# EAGLE design Power HUB (EAGLE 9.0.0)
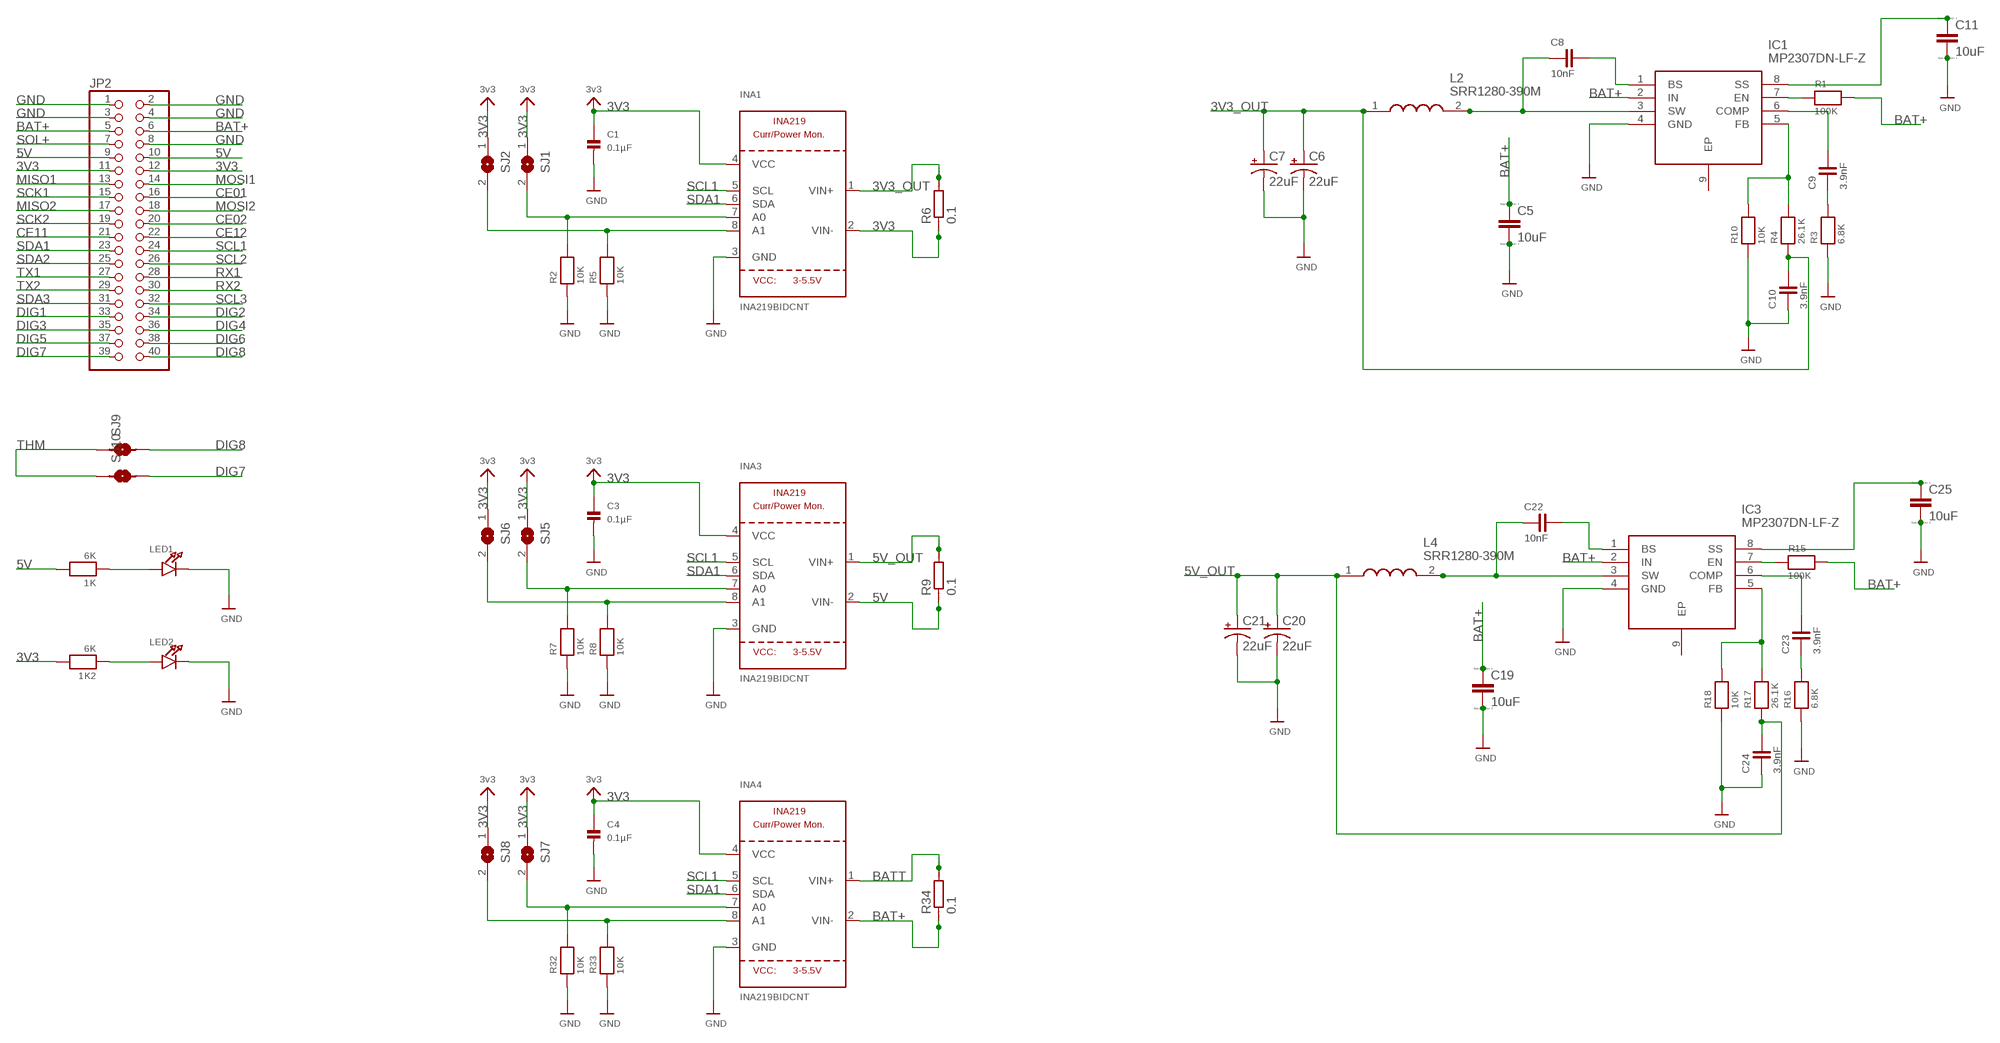
[diagram p0: schematic, sheet 1, part 1 of 2]
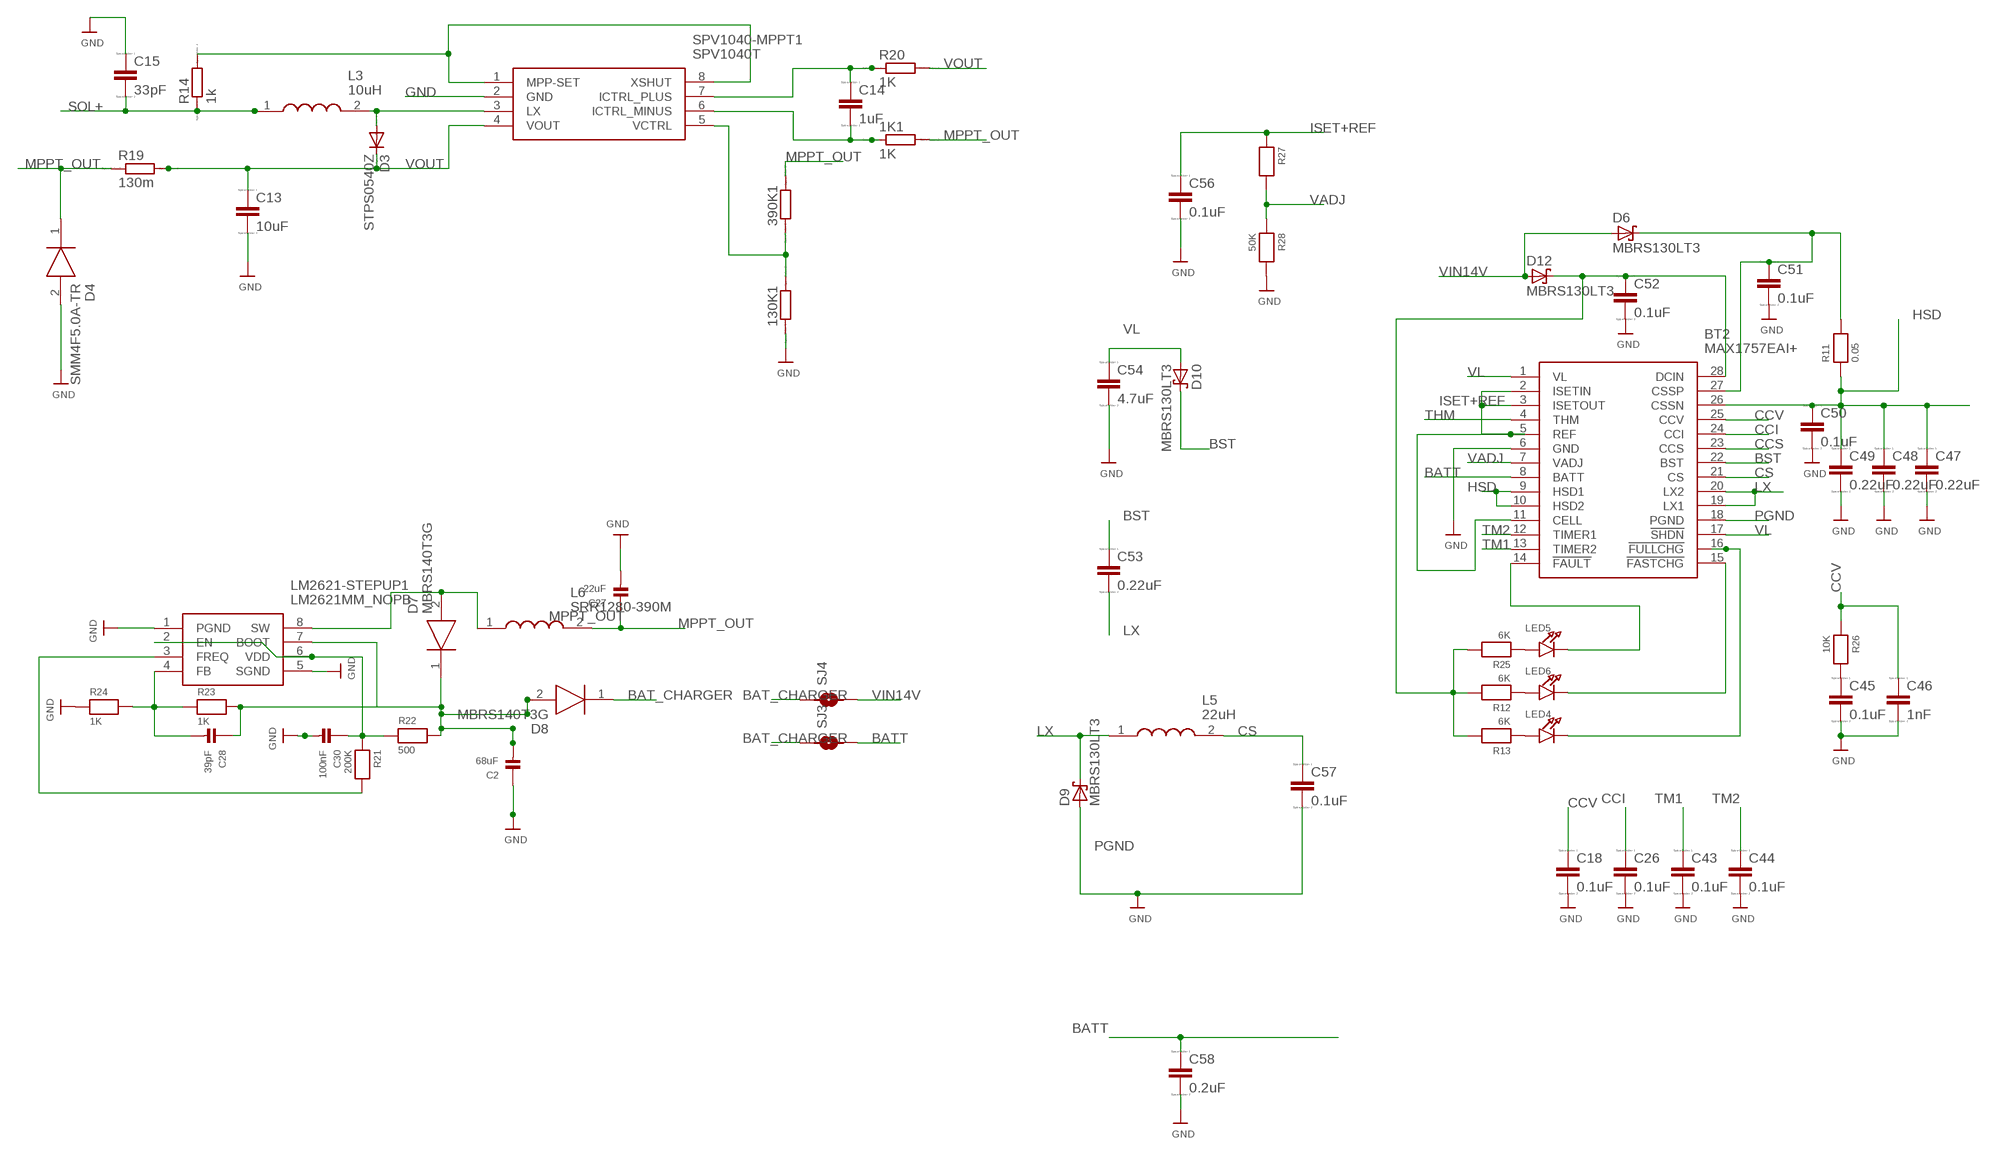
[diagram p1: schematic, sheet 1, part 2 of 2]

## Parts
1K  6K  RESISTOR1206  [1206]
1K1  1K  RR1206  [R1206]
1K2  6K  RESISTOR1206  [1206]
130K1  RR1206  [R1206]
390K1  RR1206  [R1206]
BT2  MAX1757EAI+  [SOP65P778X199-28N]
C1  0.1µF  CAP_CERAMIC1206  [1206]
C2  68uF  CAP_CERAMIC1206  [1206]
C3  0.1µF  CAP_CERAMIC1206  [1206]
C4  0.1µF  CAP_CERAMIC1206  [1206]
C5  10uF  CC1206  [C1206]
C6  22uF  47UF-10V-10%(TANT)  [EIA3528]
C7  22uF  47UF-10V-10%(TANT)  [EIA3528]
C8  10nF  CAPACITOR-0805  [0805]
C9  3.9nF  CAPACITOR-0805  [0805]
C10  3.9nF  CAPACITOR-0805  [0805]
C11  10uF  CC1206  [C1206]
C13  10uF  CC1206  [C1206]
C14  1uF  CC1206  [C1206]
C15  33pF  CC1206  [C1206]
C18  0.1uF  CC1206  [C1206]
C19  10uF  CC1206  [C1206]
C20  22uF  47UF-10V-10%(TANT)  [EIA3528]
C21  22uF  47UF-10V-10%(TANT)  [EIA3528]
C22  10nF  CAPACITOR-0805  [0805]
C23  3.9nF  CAPACITOR-0805  [0805]
C24  3.9nF  CAPACITOR-0805  [0805]
C25  10uF  CC1206  [C1206]
C26  0.1uF  CC1206  [C1206]
C27  22uF  CAP_CERAMIC1206  [1206]
C28  39pF  CAP_CERAMIC1206  [1206]
C30  100nF  CAP_CERAMIC1206  [1206]
C43  0.1uF  CC1206  [C1206]
C44  0.1uF  CC1206  [C1206]
C45  0.1uF  CC1206  [C1206]
C46  1nF  CC1206  [C1206]
C47  0.22uF  CC1206  [C1206]
C48  0.22uF  CC1206  [C1206]
C49  0.22uF  CC1206  [C1206]
C50  0.1uF  CC1206  [C1206]
C51  0.1uF  CC1206  [C1206]
C52  0.1uF  CC1206  [C1206]
C53  0.22uF  CC1206  [C1206]
C54  4.7uF  CC1206  [C1206]
C56  0.1uF  CC1206  [C1206]
C57  0.1uF  CC1206  [C1206]
C58  0.2uF  CC1206  [C1206]
D3  STPS0540Z  CGRM4001-G  [SOD-123_MINI-SMA]
D4  SMM4F5.0A-TR  [STMITE]
D6  MBRS130LT3  [SMB]
D7  MBRS140T3G  [DIOM5436X247N]
D8  MBRS140T3G  [DIOM5436X247N]
D9  MBRS130LT3  [SMB]
D10  MBRS130LT3  [SMB]
D12  MBRS130LT3  [SMB]
IC1  MP2307DN-LF-Z  [SOIC127P600X170-9N]
IC3  MP2307DN-LF-Z  [SOIC127P600X170-9N]
INA1  INA219BIDCNT  INA219  [SOT23-8]
INA3  INA219BIDCNT  INA219  [SOT23-8]
INA4  INA219BIDCNT  INA219  [SOT23-8]
JP2  PINHD-2X20  [2X20]
L2  SRR1280-390M  [SRR1280-220M]
L3  10uH  SRR1280-390M  [SRR1280-220M]
L4  SRR1280-390M  [SRR1280-220M]
L5  22uH  74406043100  [INDPM4848X280N]
L6  SRR1280-390M  [SRR1280-220M]
LED1  LED1206  [CHIPLED_1206]
LED2  LED1206  [CHIPLED_1206]
LED4  LED1206  [CHIPLED_1206]
LED5  LED1206  [CHIPLED_1206]
LED6  LED1206  [CHIPLED_1206]
LM2621-STEPUP1  LM2621MM_NOPB  [SOP65P490X110-8N]
R1  100K  RESISTOR1206  [1206]
R2  10K  RESISTOR1206  [1206]
R3  6.8K  RESISTOR1206  [1206]
R4  26.1K  RESISTOR1206  [1206]
R5  10K  RESISTOR1206  [1206]
R6  0.1  RR2512  [R2512]
R7  10K  RESISTOR1206  [1206]
R8  10K  RESISTOR1206  [1206]
R9  0.1  RR2512  [R2512]
R10  10K  RESISTOR1206  [1206]
R11  0.05  RESISTOR1206  [1206]
R12  6K  RESISTOR1206  [1206]
R13  6K  RESISTOR1206  [1206]
R14  1k  RR1206  [R1206]
R15  100K  RESISTOR1206  [1206]
R16  6.8K  RESISTOR1206  [1206]
R17  26.1K  RESISTOR1206  [1206]
R18  10K  RESISTOR1206  [1206]
R19  130m  RR1206  [R1206]
R20  1K  RR1206  [R1206]
R21  200K  RESISTOR1206  [1206]
R22  500  RESISTOR1206  [1206]
R23  1K  RESISTOR1206  [1206]
R24  1K  RESISTOR1206  [1206]
R25  6K  RESISTOR1206  [1206]
R26  10K  RESISTOR1206  [1206]
R27  RESISTOR1206  [1206]
R28  50K  RESISTOR1206  [1206]
R32  10K  RESISTOR1206  [1206]
R33  10K  RESISTOR1206  [1206]
R34  0.1  RR2512  [R2512]
SJ1  SOLDERJUMPERREFLOW_NOPASTE  [SOLDERJUMPER_REFLOW_NOPASTE]
SJ2  SOLDERJUMPERREFLOW_NOPASTE  [SOLDERJUMPER_REFLOW_NOPASTE]
SJ3  SMD-JUMPER-2  [SMD-JUMPER-2]
SJ4  SMD-JUMPER-2  [SMD-JUMPER-2]
SJ5  SOLDERJUMPERREFLOW_NOPASTE  [SOLDERJUMPER_REFLOW_NOPASTE]
SJ6  SOLDERJUMPERREFLOW_NOPASTE  [SOLDERJUMPER_REFLOW_NOPASTE]
SJ7  SOLDERJUMPERREFLOW_NOPASTE  [SOLDERJUMPER_REFLOW_NOPASTE]
SJ8  SOLDERJUMPERREFLOW_NOPASTE  [SOLDERJUMPER_REFLOW_NOPASTE]
SJ9  SMD-JUMPER-2  [SMD-JUMPER-2]
SJ10  SMD-JUMPER-2  [SMD-JUMPER-2]
SPV1040-MPPT1  SPV1040T  [SOP65P640X120-8N]

## Nets
3V3: 1K2.2 C1.1 C3.1 C4.1 INA1.2(VIN-) INA1.4(VCC) INA3.4(VCC) INA4.4(VCC) JP2.11 JP2.12 R6.1 SJ1.1 SJ2.1 SJ5.1 SJ6.1 SJ7.1 SJ8.1 ; supply symbol labelled 3v3
3V3_OUT: C6.A(+) C7.A(+) C10.2 INA1.1(VIN+) L2.1 R4.1 R6.2
5V: 1K.2 INA3.2(VIN-) JP2.9 JP2.10 R9.1
5V_OUT: C20.A(+) C21.A(+) C24.2 INA3.1(VIN+) L4.1 R9.2 R17.1
BAT+: C5.1 C19.1 IC1.2(IN) IC3.2(IN) INA4.2(VIN-) JP2.5 JP2.6 R1.2 R15.2 R34.1
BAT_CHARGER: D8.1(K) SJ3.1 SJ4.1
BATT: BT2.8(BATT) C58.1 INA4.1(VIN+) R34.2 SJ3.2
BST: BT2.22(BST) C53.1 D10.C
CCI: BT2.24(CCI) C26.1
CCS: BT2.23(CCS)
CCV: BT2.25(CCV) C18.1 C46.1 R26.1
CE01: JP2.16
CE02: JP2.20
CE11: JP2.21
CE12: JP2.22
CS: BT2.21(CS) C57.1 L5.2
DIG1: JP2.33
DIG2: JP2.34
DIG3: JP2.35
DIG4: JP2.36
DIG5: JP2.37
DIG6: JP2.38
DIG7: JP2.39 SJ10.2
DIG8: JP2.40 SJ9.2
GND: 130K1.1 BT2.6(GND) C1.2 C2.1 C3.2 C4.2 C5.2 C6.C(-) C7.C(-) C10.1 C11.2 C13.2 C15.1 C19.2 C20.C(-) C21.C(-) C24.1 C25.2 C27.2 C30.2 C45.2 C46.2 C47.2 C48.2 C49.2 C54.2 C56.2 C58.2 D4.2(A) IC1.4(GND) IC3.4(GND) INA1.3(GND) INA3.3(GND) INA4.3(GND) JP2.1 JP2.2 JP2.3 JP2.4 JP2.8 LED1.C LED2.C LM2621-STEPUP1.1(PGND) LM2621-STEPUP1.5(SGND) R2.1 R3.1 R5.1 R7.1 R8.1 R10.1 R16.1 R18.1 R24.1 R32.1 R33.1 SPV1040-MPPT1.2(GND)
HSD: BT2.9(HSD1) BT2.10(HSD2) BT2.26(CSSN) C47.1 C48.1 C49.1 C50.1 R11.1
ISET+REF: BT2.2(ISETIN) BT2.3(ISETOUT) BT2.5(REF) BT2.11(CELL) C56.1 R27.1
LX: BT2.19(LX1) BT2.20(LX2) C53.2 D9.C L5.1
MISO1: JP2.13
MISO2: JP2.17
MOSI1: JP2.14
MOSI2: JP2.18
MPPT_OUT: 1K1.2 390K1.2 C27.1 D4.1(K) L6.2 R19.1
N$1: INA1.8(A1) R5.2 SJ2.2
N$2: INA1.7(A0) R2.2 SJ1.2
N$3: C8.2 IC1.1(BS)
N$4: C11.1 IC1.8(SS)
N$5: INA3.8(A1) R8.2 SJ6.2
N$6: INA3.7(A0) R7.2 SJ5.2
N$7: C8.1 IC1.3(SW) L2.2
N$8: IC1.7(EN) R1.1
N$9: C9.2 IC1.6(COMP)
N$10: C9.1 R3.2
N$11: IC1.5(FB) R4.2 R10.2
N$12: 1K2.1 LED2.A
N$13: 1K.1 LED1.A
N$15: BT2.28(DCIN) C52.1 D12.C R12.2 R13.2 R25.2
N$16: BT2.14(!FAULT) LED5.C
N$17: D3.A L3.2 SPV1040-MPPT1.3(LX)
N$18: R14.2 SPV1040-MPPT1.1(MPP-SET) SPV1040-MPPT1.8(XSHUT)
N$19: C22.2 IC3.1(BS)
N$20: C25.1 IC3.8(SS)
N$21: C22.1 IC3.3(SW) L4.2
N$22: IC3.7(EN) R15.1
N$23: C23.2 IC3.6(COMP)
N$24: C23.1 R16.2
N$25: IC3.5(FB) R17.2 R18.2
N$26: C14.1 R20.1 SPV1040-MPPT1.7(ICTRL_PLUS)
N$27: 1K1.1 C14.2 SPV1040-MPPT1.6(ICTRL_MINUS)
N$28: 130K1.2 390K1.1 SPV1040-MPPT1.5(VCTRL)
N$29: BT2.15(!FASTCHG) LED6.C
N$30: BT2.16(!FULLCHG) LED4.C
N$35: INA4.8(A1) R33.2 SJ8.2
N$36: C2.2 D7.1(K) D8.2(A) LM2621-STEPUP1.7(BOOT) R22.2
N$37: C30.1 LM2621-STEPUP1.2(EN) LM2621-STEPUP1.6(VDD) R21.1 R22.1
N$38: LM2621-STEPUP1.3(FREQ) R21.2
N$39: C28.2 LM2621-STEPUP1.4(FB) R23.1 R24.2
N$40: C28.1 R23.2
N$42: D7.2(A) L6.1 LM2621-STEPUP1.8(SW)
N$43: INA4.7(A0) R32.2 SJ7.2
N$50: BT2.27(CSSP) C51.1 D6.C R11.2
PGND: BT2.18(PGND) C57.2 D9.A ; supply symbol labelled GND
RX1: JP2.28
RX2: JP2.30
SCK1: JP2.15
SCK2: JP2.19
SCL1: INA1.5(SCL) INA3.5(SCL) INA4.5(SCL) JP2.24
SCL2: JP2.26
SCL3: JP2.32
SDA1: INA1.6(SDA) INA3.6(SDA) INA4.6(SDA) JP2.23
SDA2: JP2.25
SDA3: JP2.31
SOL+: C15.2 JP2.7 L3.1 R14.1
THM: BT2.4(THM) SJ9.1 SJ10.1
TM1: BT2.13(TIMER2) C43.1
TM2: BT2.12(TIMER1) C44.1
TX1: JP2.27
TX2: JP2.29
VADJ: BT2.7(VADJ) R27.2 R28.1
VIN14V: D6.A D12.A SJ4.2
VL: BT2.1(VL) BT2.17(!SHDN) C54.1 D10.A
VOUT: C13.1 D3.C R19.2 R20.2 SPV1040-MPPT1.4(VOUT)
Unconnected: C18.2 C26.2 C43.2 C44.2 C45.1 C50.2 C51.2 C52.2 IC1.9(EP) IC3.9(EP) LED4.A LED5.A LED6.A R12.1 R13.1 R25.1 R26.2 R28.2

## Library data of the parts
1K 1K2 R1-R5 R7 R8 R10-R13 R15-R18 R21-R28 R32 R33 = microbuilder:RESISTOR: Resistors 0402 - 0402 Surface Mount Package 22 Ohm 1% 1/16W [Digikey: 311-22.0LRTR-ND] 33 Ohm 5% 1/16W 1.0K 5% 1/16W 1.5K 5% 1/16W 2.0K 1% 1/16W 10.0K 1% 1/16W [Digikey: 311-10.0KLRTR-ND] 10.0K 5% 1/16W [Digikey: RMCF0402JT10K0TR-ND] 12.1K 1% 1/16W [Digikey: 311-22.0LRTR-ND] 100.0K 5% 1/16W 0603 - 0603 Surface Mount Package 0 Ohm 1/10 Watt 1% Resistor 15 Ohm 1/10 Watt 1% Resistor 33 Ohm 1/10 Watt 1% Resistor 49.9 Ohm 1/10 Watt 1% Resistor 100 Ohm 1/10 Watt 1% Resistor 150 Ohm 1/10 Watt 1% Resistor 240 Ohm 1/10 Watt 1% Resistor 390 Ohm 1/10 Watt 1% Resistor 560 Ohm 1/10 Watt 1% Resistor 680 Ohm 1/10 Watt 1% Resistor 750 Ohm 1/10 Watt 1% Resistor 1.0K Ohm 1/10 Watt 1% Resistor 1.5K Ohm 1/10 Watt 1% Resistor 2.0K Ohm 1/10 Watt 1% Resistor 2.2K Ohm 1/10 Watt 1% Resistor 3.3K Ohm 1/10 Watt 1% Resistor 4.7K Ohm 1/10 Watt 1% Resistor 10.0K Ohm 1/10 Watt 1% Resistor 12.0K Ohm 1/10 Watt 1% Resistor 12.1K Ohm 1/10 Watt 1% Resistor 20.0K Ohm 1/10 Watt 1% Resistor 33.0K Ohm 1/10 Watt 1% Resistor 100.0K Ohm 1/10 Watt 1% Resistor 0805 - 0805 Surface Mount Package 0 Ohm 1/8 Watt 1% Resistor 33 Ohm 1/8 Watt 1% Resistor 100 Ohm 1/8 Watt 1% Resistor 150 Ohm 1/8 Watt 1% Resistor 200 Ohm 1/8 Watt 1% Resistor 240 Ohm 1/8 Watt 1% Resistor 330 Ohm 1/8 Watt 1% Resistor 390 Ohm 1/8 Watt 1% Resistor 470 Ohm 1/8 Watt 1% Resistor 1.0K Ohm 1/8 Watt 1% Resistor 1.5K Ohm 1/8 Watt 1% Resistor 2.0K Ohm 1/8 Watt 1% Resistor 4.7K Ohm 1/8 Watt 1% Resistor 5.1K Ohm 1/8 Watt 1% Resistor 5.6K Ohm 1/8 Watt 1% Resistor 10.0K Ohm 1/8 Watt 1% Resistor 22.0K Ohm 1/8 Watt 1% Resistor 33.0K Ohm 1/8 Watt 1% Resistor 100K Ohm 1/8 Watt 1% Resistor 1206 - 1206 Surface Mount Package 2012 - 2010 Surface Mount Package 0.11 Ohm 1/2 Watt 1% Resistor - Digikey: RHM.11UCT-ND
1K1 130K1 390K1 R6 R9 R14 R19 R20 R34 = eagle-ltspice:R: RESISTOR, European symbol; SPICEMODEL: NONE; SPICEPREFIX: R
BT2 = MAX1757EAI+:MAX1757EAI+: MAXIM INTEGRATED PRODUCTS - MAX1757EAI+ - BATTERY CHARGER, LI-ION, 1.5A, SSOP-28 Source: Datasheet <http://www.farnell.com/datasheets/2001967.pdf>; ARROW_PART_NUMBER: MAX1757EAI+; DESCRIPTION: MAXIM INTEGRATED PRODUCTS - MAX1757EAI+ - BATTERY CHARGER, LI-ION, 1.5A, SSOP-28; HEIGHT: 1.99mm; MANUFACTURER_NAME: Maxim Integrated; MANUFACTURER_PART_NUMBER: MAX1757EAI+
C1-C4 C27 C28 C30 = microbuilder:CAP_CERAMIC: Ceramic Capacitors 0402 - 0402 Surface Mount Capacitors 16pF 50V 5% [Digikey: 445-4899-2-ND] 18pF 50V 5% [Digikey: 490-1281-2-ND] 22pF 50V 5% [Digikey: 490-1283-2-ND] 68pF 50V 5% [Digikey: 490-1289-2-ND] 0.1uF 10V 10% [Digikey: 490-1318-2-ND] 1.0uF 6.3V 10% [Digikey: 490-1320-2-ND] 0603 - 0603 Surface Mount Capacitors 16 pF 50V 5% [Digikey: 445-5051-2-ND] 22 pF 50V [Digikey: PCC220ACVTR-ND] 33 pF 50V 5% [Digikey: 490-1415-1-ND] 56pF 50V 5% [Digikey: 490-1421-1-ND] 220pF 50V 5% [Digikey: 445-1285-1-ND] 680 pF 50V 2200 pF 50V 5% C0G [Digikey: 445-1297-1-ND] 5600 pF 100V 5% X7R [Digikey: 478-3711-1-ND] 0.1 µF 25V 10% [Digikey: PCC2277TR-ND] 0.22 µF 16V 10% X7R [Digikey: 445-1318-1-ND] 1.0 µF 25V 10% [Digikey: 445-5146-2-ND] 0603 - RF Specific 3pF 250V +/-0.1pF RF [Digikey: 712-1347-1-ND] 18 pF 250V 5% [Digikey: 478-3505-1-ND or 712-1322-1-ND] 56 pF 250V 5% C0G RF [Digikey: 490-4867-1-ND] 68 pF 250V RF [Digikey: 490-4868-1-ND] 0805 - 0805 Surface Mount Capacitors 220 pF 250V 2% RF Ceramic Capacitor [Digikey: 712-1398-1-ND] 1000 pF 50V 2% NP0 Ceramic Capacitor [Digikey: 478-3760-1-ND] 0.1 µF 25V 10% Ceramic Capacitor [Digikey: PCC1828TR-ND] 1.0 µF 16V 10% Ceramic Capacitor[Digikey: 490-1691-2-ND] 10.0 µF 10V 10% Ceramic Capacitor[Digikey: 709-1228-1-ND] 10.0 uF 16V 10% Ceramic Capacitor [Digikey: 478-5165-2-ND] 47 uF 6.3V 20% Ceramic Capacitor [Digikey: 587-1779-1-ND or 399-5506-1-ND] 1206 - 1206 Surface Mount Capacitors 47uF 10V 20% Ceramic Capacitor [Digikey: 490-5528-1-ND or 399-5508-1-ND or 445-6010-1-ND] 100uF 6.3V -20%, +80% Y5V Ceramic Capacitor (Digikey: 490-4512-1-ND, Mouser: 81-GRM31CF50J107ZE1L)
C5 C11 C13-C15 C18 C19 C25 C26 C43-C54 C56-C58 = eagle-ltspice:C: CAPACITOR, European symbol; SPICEMODEL: NONE; SPICEPREFIX: C
C6 C7 C20 C21 = SparkFun-Capacitors:47UF-10V-10%(TANT): CAP-08310 47uF Tantalum SMT 10V 10% (EIA-3528); PROD_ID: CAP-08310; VALUE: 47uF
C8-C10 C22-C24 = FaBo-Capacitor:CAPACITOR: CAPACITOR
D3 = diode:CGRM400*-G: Molded plasitc,JEDEC SOD-123/Mini SMA Source: Comchip CGRM4001-G.pdf
D4 = SMM4F5.0A-TR:SMM4F5.0A-TR: ESD Suppressors / TVS Diodes 400W HI JCT TMP Source: Datasheet <http://www.st.com/content/ccc/resource/technical/document/datasheet/5d/b3/40/b8/ac/6c/49/a2/CD00178940.pdf/files/CD00178940.pdf/jcr:content/translations/en.CD00178940.pdf>; ARROW_PART_NUMBER: SMM4F5.0A-TR; ARROW_PRICE/STOCK: https://www.arrow.com/en/products/smm4f5.0a-tr/stmicroelectronics; DESCRIPTION: ESD Suppressors / TVS Diodes 400W HI JCT TMP; HEIGHT: mm; MANUFACTURER_NAME: STMicroelectronics; MANUFACTURER_PART_NUMBER: SMM4F5.0A-TR
D6 D9 D10 D12 = diode:MBRS130LT3: Schottky Power Rectifier Source: http://www.onsemi.com/pub/Collateral/MBRS130LT3-D.PDF
D7 D8 = MBRS140T3G:MBRS140T3G: Source: Datasheet <http://www.onsemi.com/pub/Collateral/MBRS140T3-D.PDF>; ALLIED_NUMBER: 70099505; ALLIED_PRICE/STOCK: http://www.alliedelec.com/on-semiconductor-mbrs140t3g/70099505/; ARROW_PART_NUMBER: MBRS140T3G; ARROW_PRICE/STOCK: https://www.arrow.com/en/products/mbrs140t3g/on-semiconductor; HEIGHT: 2.47mm; MANUFACTURER_NAME: ON Semiconductor; MANUFACTURER_PART_NUMBER: MBRS140T3G; RS_PART_NUMBER: 5452074P; RS_PRICE/STOCK: http://uk.rs-online.com/web/p/products/5452074P
IC1 IC3 = MP2307DN-LF-Z:MP2307DN-LF-Z: Switching Voltage Regulators 3A/23VSynchRectified Step-down Converter Source: Datasheet <http://www.mouser.com/ds/2/277/MP2307_r1.9-371737.pdf>; ARROW_PART_NUMBER: MP2307DN-LF-Z; DESCRIPTION: Switching Voltage Regulators 3A/23VSynchRectified Step-down Converter; HEIGHT: 1.7mm; MANUFACTURER_NAME: Monolithic Power Systems (MPS); MANUFACTURER_PART_NUMBER: MP2307DN-LF-Z
INA1 INA3 INA4 = microbuilder:INA219: INA219 - I2C Current/Power Monitor Voltage Range: 0-26V Accuracy: 0.5% Temperature: -40°C - 125°C
JP2 = pinhead:PINHD-2X20: PIN HEADER
L2-L4 L6 = SRR1280-390M:SRR1280-390M: SRR1280-390M - Power Inductor (SMD), 39 H, 3.2 A, 3.1 A, SRR1280 Series, 12.5mm x 12.5mm x 7.5mm, Shielded Source: Datasheet <http://www.bourns.com/docs/product-datasheets/srr1280.pdf>; ARROW_PART_NUMBER: SRR1280-390M; ARROW_PRICE/STOCK: https://www.arrow.com/en/products/srr1280-390m/bourns; DESCRIPTION: SRR1280-390M - Power Inductor (SMD), 39 H, 3.2 A, 3.1 A, SRR1280 Series, 12.5mm x 12.5mm x 7.5mm, Shielded; HEIGHT: mm; MANUFACTURER_NAME: Bourns; MANUFACTURER_PART_NUMBER: SRR1280-390M
L5 = 74406043100:74406043100: Fixed Inductors WE-LQFS 4828 10uH 1.77A 86mOhms Source: Datasheet <https://katalog.we-online.de/pbs/datasheet/74406043100.pdf>; ARROW_PART_NUMBER: 74406043100; ARROW_PRICE/STOCK: http://uk.rs-online.com/web/p/products/1354930; DESCRIPTION: Fixed Inductors WE-LQFS 4828 10uH 1.77A 86mOhms; HEIGHT: 2.8mm; MANUFACTURER_NAME: Wurth Elektronik; MANUFACTURER_PART_NUMBER: 74406043100; RS_PART_NUMBER: 1354930; RS_PRICE/STOCK: http://uk.rs-online.com/web/p/products/1354930
LED1 LED2 LED4-LED6 = microbuilder:LED: LED 0603 - 0603 Surface Mount Package 2mA: Green LED - Low Power (3.9mcd, 2ma, 1.7Vf) - Digikey: 475-2709-2-ND Orange LED - Low Power (9.8mcd, 2ma, 1.8Vf) - Digikey: 475-1194-2-ND Red LED - Low Power (5mcd, 2ma, 1.8Vf) - Digikey: 475-1195-2-ND Yellow LED - Low Power (7mcd, 2ma, 1.8Vf) - Digikey: 475-1196-2-ND 5mA: Blue LED - Low Power (17mcd, 5ma, 2.9Vf) - Digikey: LNJ937W8CRACT-ND 0805 - 0805 Surface Mount Package 2mA: Red LED (8.8mcd, 2mA, 1.8Vf, Clear) - Low Power [Digikey: 475-2510-1-ND] Green LED (5mcd, 2mA, 1.8Vf, Clear) - Low Power [Digikey: 475-2730-1-ND] Yellow LED (11.3mcd, 2mA, 1.8Vf, Clear) - Low Power [Digikey: 475-2555-1-ND] 20mA: Red LED (104mcd, 20mA, Diffused) - LS R976 [Digikey: 475-1278-6-ND] Red LED (12mcd, 20mA, 2.0Vf, Clear) - APT2012EC [Digikey: 754-1128-1-ND] Green LED (15mcd, 20mA, 2.2Vf, Clear) - APT2012GC [Digikey: 754-1131-1-ND] Orange LED (160mcd, 20mA, 2.1Vf, Clear) - APT2012SECK [Digikey: 754-1130-1-ND] 1206 - 1206 Surface Mount Package Green LED (26mcd, 20mA, Diffused) - LG N971 [Digikey: 475-1407-6-ND] Red LED (15mcd, 20mA, Diffused) - LH N974 [Digikey: 475-1416-6-ND]
LM2621-STEPUP1 = LM2621MM_NOPB:LM2621MM_NOPB: 1.2-V to 14-V Input Voltage, Step-Up DC-DC Source: Datasheet <http://www.ti.com/lit/ds/symlink/lm2621.pdf>; ARROW_PART_NUMBER: LM2621MM/NOPB; ARROW_PRICE/STOCK: https://www.arrow.com/en/products/lm2621mmnopb/texas-instruments; DESCRIPTION: 1.2-V to 14-V Input Voltage, Step-Up DC-DC; HEIGHT: 1.1mm; MANUFACTURER_NAME: Texas Instruments; MANUFACTURER_PART_NUMBER: LM2621MM/NOPB; RS_PART_NUMBER: 5333872P; RS_PRICE/STOCK: http://uk.rs-online.com/web/p/products/5333872P
SJ1 SJ2 SJ5-SJ8 = microbuilder:SOLDERJUMPER: SMD Solder JUMPER Solder the two pads together to create a connection, or remove the solder to break it. REFLOW - Use this footprint for solder paste and reflow ovens. WAVE - Use this footprint for hand-soldering (larger pads). CLOSED - Has a trace between the two pads to ensure it is closed by default. The trace needs to be cut to disable the jumper, and can be closed again by creating a solder bridge between the two pads.
SJ3 SJ4 SJ9 SJ10 = FaBo-etc:SMD-JUMPER-2
SPV1040-MPPT1 = SPV1040T:SPV1040T: Voltage Regulators - Switching Regulators Hi efficiency solar battery charger Source: Datasheet <http://www.mouser.com/ds/2/389/spv1040-974182.pdf>; ARROW_PART_NUMBER: SPV1040T; ARROW_PRICE/STOCK: https://www.arrow.com/en/products/spv1040t/stmicroelectronics; DESCRIPTION: Voltage Regulators - Switching Regulators Hi efficiency solar battery charger; HEIGHT: 1.2mm; MANUFACTURER_NAME: STMicroelectronics; MANUFACTURER_PART_NUMBER: SPV1040T

## Board
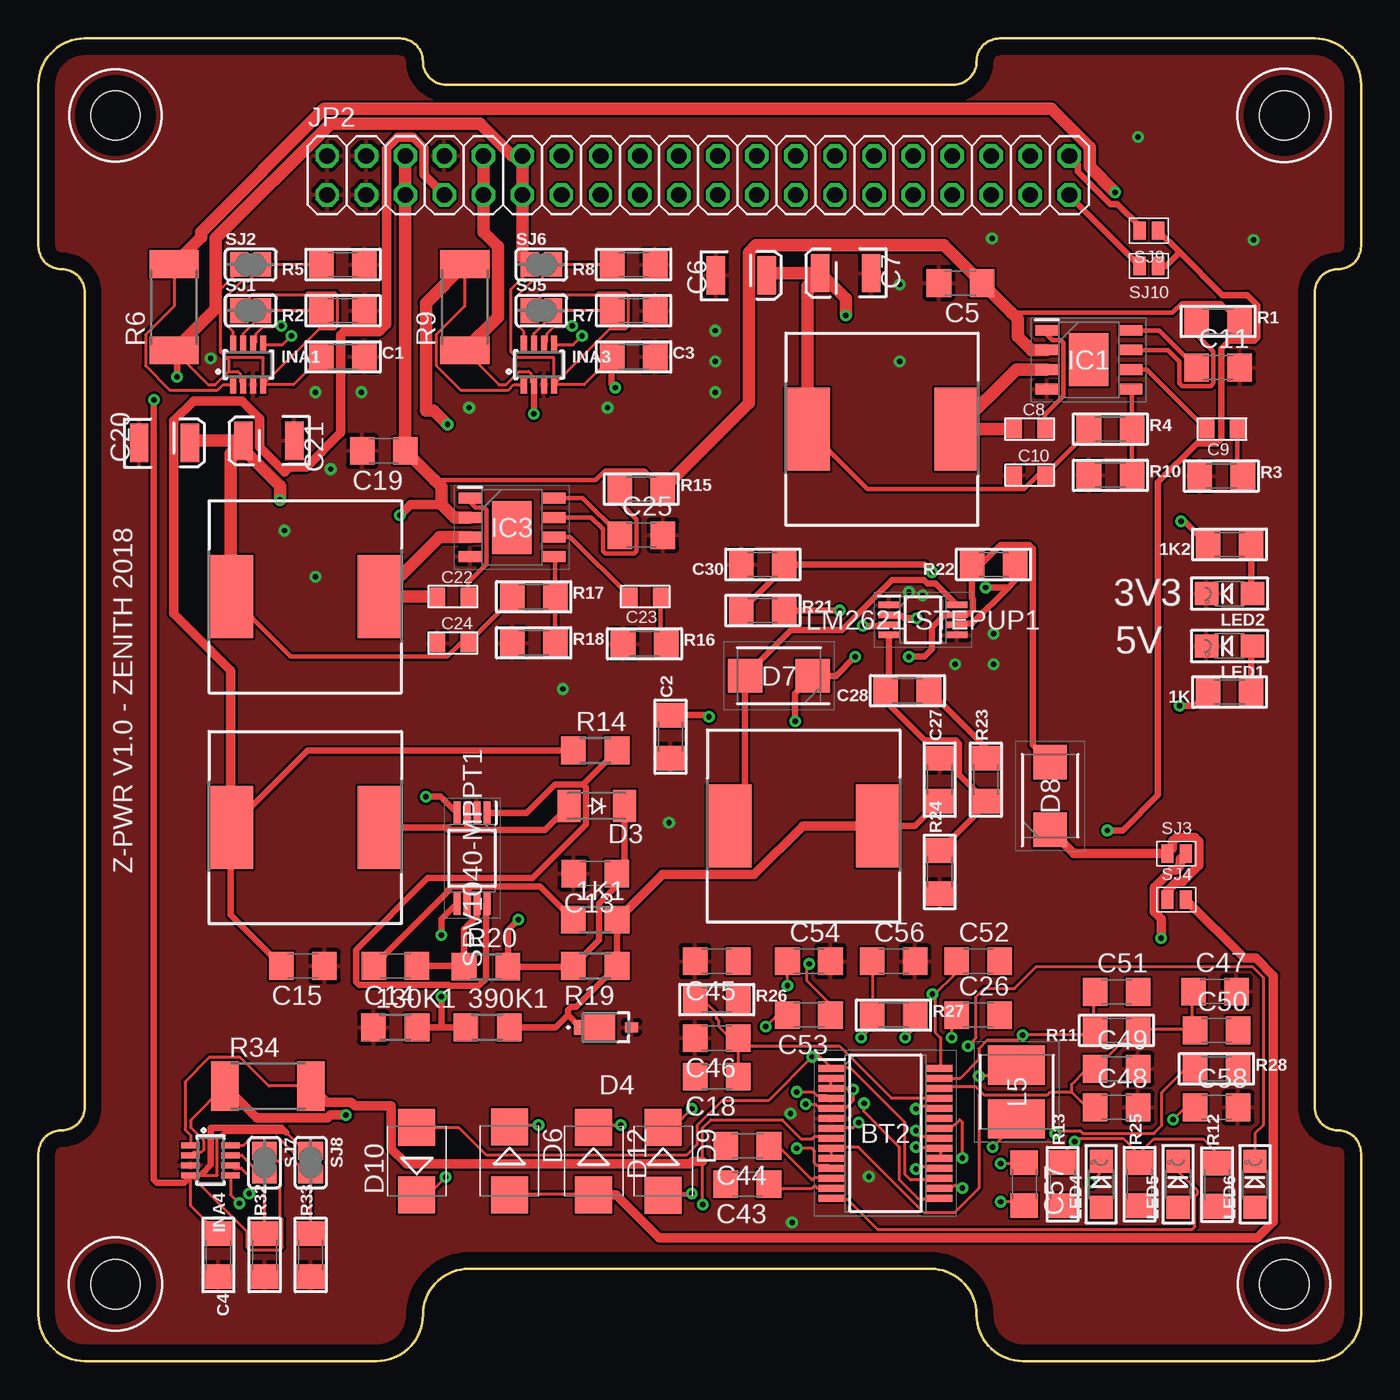
[diagram p2: board, top side]
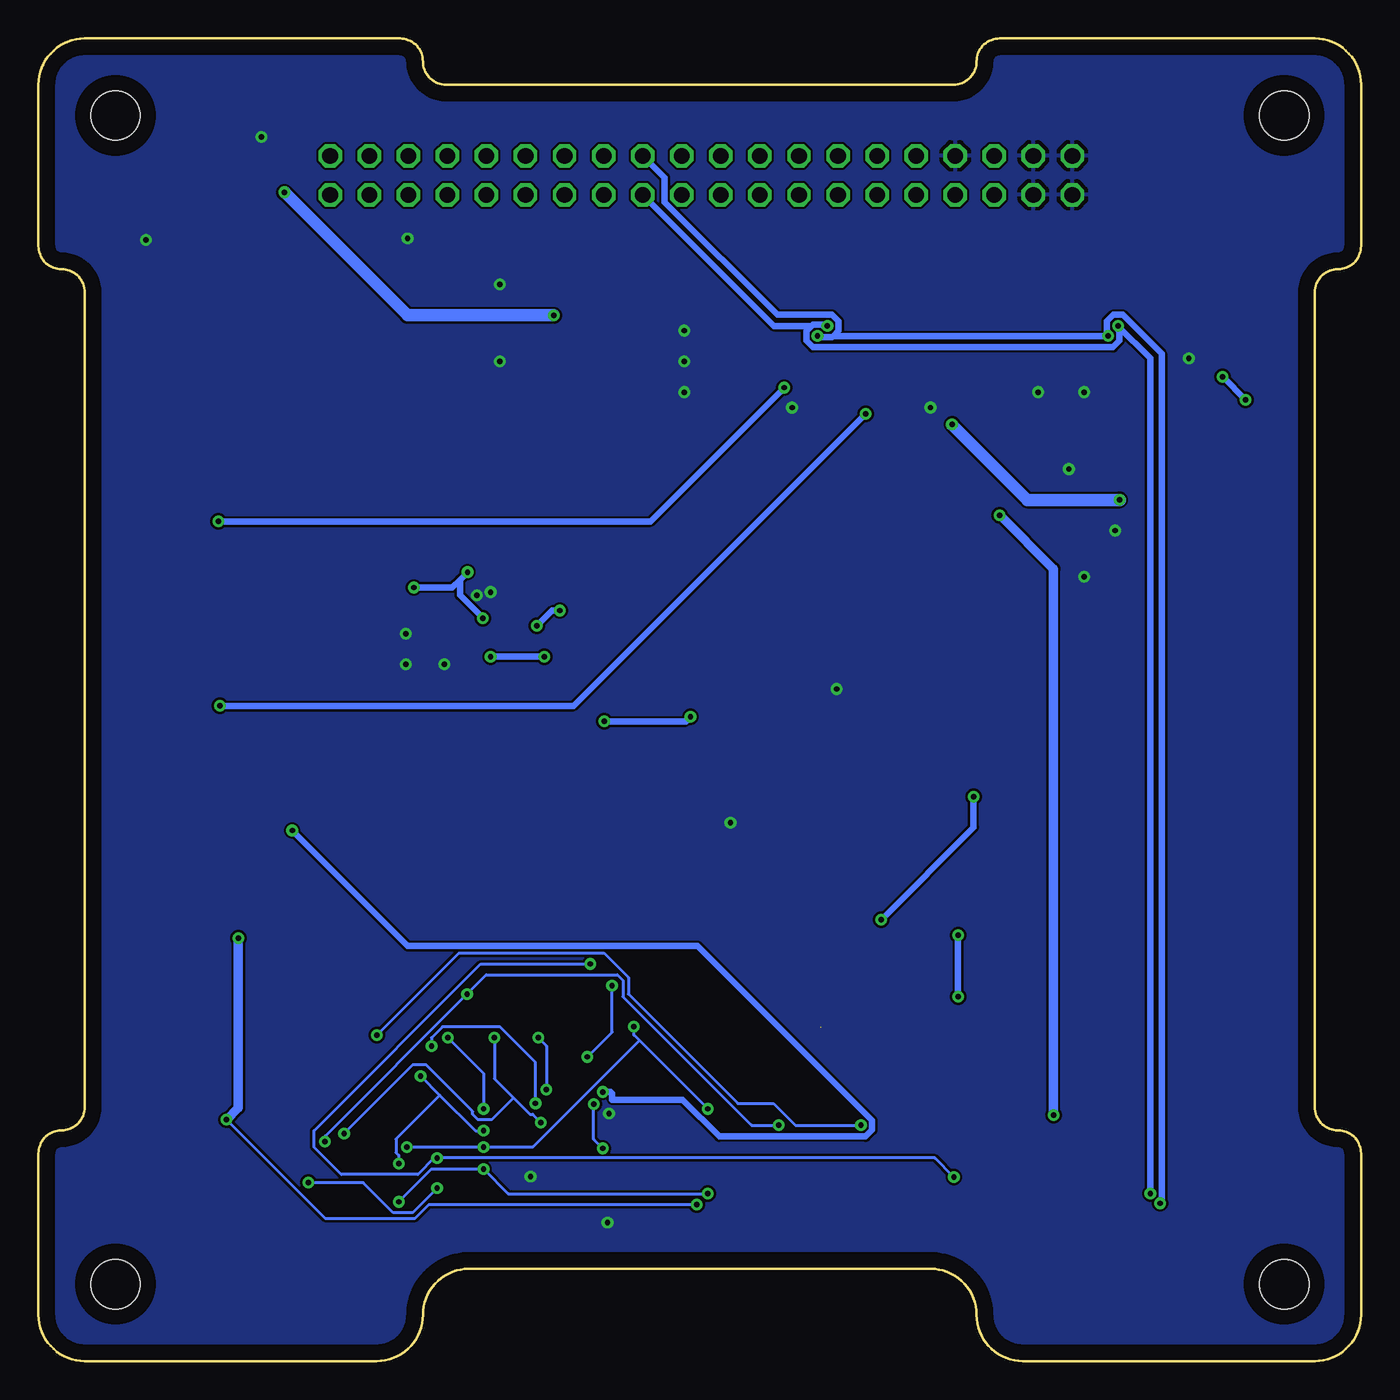
[diagram p3: board, bottom side, seen from below]

Size 86 x 86 mm. Coordinates in mm from the lower left corner, seen from the top.
Outline: 0,83 0,72.5 arc90 1.5,71 arc-90 3,69.5 3,16.5 arc-90 1.5,15 arc90 0,13.5 0,3 arc90 3,0 22,0 arc90 25,3 arc-90 28,6 58,6 arc-90 61,3 arc90 64,0 83,0 arc90 86,3 86,13.5 arc90 84.5,15 arc-90 83,16.5 83,69.5 arc-90 84.5,71 arc90 86,72.5 86,83 arc90 83,86 62.5,86 arc90 61,84.5 arc-90 59.5,83 26.5,83 arc-90 25,84.5 arc90 23.5,86 3,86 arc90 0,83
Copper layers (1*16): Top 0.035mm / dielectric 1.5mm / Bottom 0.035mm
Design rules "default *": minimum track width 6mil, minimum drill 0.35mm, track to track 6mil, track to pad 6mil, pad to pad 6mil, via to via 6mil, smd to smd 6mil, copper to edge 40mil, drill to drill 6mil, minimum pad ring 10mil, minimum via ring 8mil, stop-mask expansion 4mil, vias tented up to drill 30mil, thermal gap 10mil
Holes 3.2 mm at 5,5 81,5 81,81 5,81

### Footprints (pad centres in the part's own frame; a part is rotated, then mirrored left to right if it is on the bottom)
1206 = smd 1.6 x 1.8: 1 -1.4,0; 2 1.4,0
R1206 = smd 1.6 x 1.803: 1 -1.422,0; 2 1.422,0
SOP65P778X199-28N = smd 1.705 x 0.45: 1 -3.498,4.225; 2 -3.498,3.575; 3 -3.498,2.925; 4 -3.498,2.275; 5 -3.498,1.625; 6 -3.498,0.975; 7 -3.498,0.325; 8 -3.498,-0.325; 9 -3.498,-0.975; 10 -3.498,-1.625; 11 -3.498,-2.275; 12 -3.498,-2.925; 13 -3.498,-3.575; 14 -3.498,-4.225; 15 3.498,-4.225; 16 3.498,-3.575; 17 3.498,-2.925; 18 3.498,-2.275; 19 3.498,-1.625; 20 3.498,-0.975; 21 3.498,-0.325; 22 3.498,0.325; 23 3.498,0.975; 24 3.498,1.625; 25 3.498,2.275; 26 3.498,2.925; 27 3.498,3.575; 28 3.498,4.225
C1206 = smd 1.6 x 1.8: 1 -1.4,0; 2 1.4,0
EIA3528 = smd 1.2 x 2.5: A 1.65,0; C -1.65,0
0805 = smd 1 x 1.2: 1 -1.254,0; 2 0.746,0
SOD-123_MINI-SMA = smd 1.5 x 2.1: A 1.8,0; C -1.8,0
STMITE = smd 0.65 x 0.95: 1 1.74,0 | smd 0.85 x 0.65: 2 -1.665,0 | smd 2 x 1.95: 3 0.415,0
SMB = smd 2.4 x 2.4: A 2.2,0; C -2.2,0
DIOM5436X247N = smd 2.25 x 2.15: 1 -2.2,0; 2 2.2,0
SOIC127P600X170-9N = smd 1.525 x 0.7: 1 -2.712,1.905; 2 -2.712,0.635; 3 -2.712,-0.635; 4 -2.712,-1.905; 5 2.712,-1.905; 6 2.712,-0.635; 7 2.712,0.635; 8 2.712,1.905 | smd 2.56 x 3.45: 9 0,0
SOT23-8 = smd 0.4 x 1.2: 1 -0.975,-1.3; 2 -0.325,-1.3; 3 0.325,-1.3; 4 0.975,-1.3; 5 0.975,1.3; 6 0.325,1.3; 7 -0.325,1.3; 8 -0.975,1.3
2X20 = drill 1.016 octagon: 1 -24.13,-1.27; 2 -24.13,1.27; 3 -21.59,-1.27; 4 -21.59,1.27; 5 -19.05,-1.27; 6 -19.05,1.27; 7 -16.51,-1.27; 8 -16.51,1.27; 9 -13.97,-1.27; 10 -13.97,1.27; 11 -11.43,-1.27; 12 -11.43,1.27; 13 -8.89,-1.27; 14 -8.89,1.27; 15 -6.35,-1.27; 16 -6.35,1.27; 17 -3.81,-1.27; 18 -3.81,1.27; 19 -1.27,-1.27; 20 -1.27,1.27; 21 1.27,-1.27; 22 1.27,1.27; 23 3.81,-1.27; 24 3.81,1.27; 25 6.35,-1.27; 26 6.35,1.27; 27 8.89,-1.27; 28 8.89,1.27; 29 11.43,-1.27; 30 11.43,1.27; 31 13.97,-1.27; 32 13.97,1.27; 33 16.51,-1.27; 34 16.51,1.27; 35 19.05,-1.27; 36 19.05,1.27; 37 21.59,-1.27; 38 21.59,1.27; 39 24.13,-1.27; 40 24.13,1.27
SRR1280-220M = smd 2.9 x 5.4: 1 -9.7,0; 2 0,0
INDPM4848X280N = smd 2.55 x 3.7: 1 -1.75,0; 2 1.75,0
CHIPLED_1206 = smd 1.5 x 1.5: A 0,-1.496; C 0,1.496
SOP65P490X110-8N = smd 1.4 x 0.45: 1 -2.2,0.975; 2 -2.2,0.325; 3 -2.2,-0.325; 4 -2.2,-0.975; 5 2.2,-0.975; 6 2.2,-0.325; 7 2.2,0.325; 8 2.2,0.975
R2512 = smd 1.8 x 3.2: 1 -2.8,0; 2 2.8,0
SOLDERJUMPER_REFLOW_NOPASTE = smd 1.168 x 1.6: 1 -0.762,0; 2 0.762,0
SMD-JUMPER-2 = smd 0.8 x 1.2: 1 -0.6,0; 2 0.6,0
SOP65P640X120-8N = smd 1.475 x 0.45: 1 -2.938,0.975; 2 -2.938,0.325; 3 -2.938,-0.325; 4 -2.938,-0.975; 5 2.938,-0.975; 6 2.938,-0.325; 7 2.938,0.325; 8 2.938,0.975

### Placement (x,y rotation side)
1K  77.45,43.5 180 top
1K1  36.2,28.7 0 top
1K2  77.45,53.1 180 top
130K1  23.2,21.7 0 top
390K1  29.2,21.7 0 top
BT2  55.07,14.82 0 top
C1  19.8,65.3 0 top
C2  41.1,40.6 90 top
C3  38.7,65.3 0 top
C4  11.7,6.9 270 top
C5  59.95,70.09 180 top
C6  45.7,70.6 0 top
C7  52.49,70.74 180 top
C8  64.7,60.6 0 top
C9  76.7,60.6 180 top
C10  64.7,57.6 0 top
C11  76.7,64.6 0 top
C13  36.2,31.7 180 top
C14  23.2,25.7 180 top
C15  17.2,25.7 180 top
C18  44.1,18.5 180 top
C19  22.45,59.19 180 top
C20  8.2,59.7 0 top
C21  14.99,59.84 180 top
C22  27.2,49.7 0 top
C23  39.2,49.7 180 top
C24  27.2,46.7 0 top
C25  39.2,53.7 0 top
C26  61.1,22.5 0 top
C27  58.6,37.8 90 top
C28  56.5,43.59 180 top
C30  47.1,51.8 180 top
C43  46.1,11.5 180 top
C44  46.1,14 180 top
C45  44.1,26 180 top
C46  44.1,21 180 top
C47  76.5,24.03 0 top
C48  70.1,16.5 0 top
C49  70.1,19 0 top
C50  76.6,21.5 0 top
C51  70.1,24 0 top
C52  61.1,26 0 top
C53  50.1,22.5 180 top
C54  50.1,26 0 top
C56  55.6,26 0 top
C57  64.1,11.5 270 top
C58  76.6,16.5 0 top
D3  36.3,36.09 180 top
D4  36.9,21.7 180 top
D6  30.62,13.02 270 top
D7  48.15,44.56 180 top
D8  65.78,36.75 90 top
D9  40.62,12.99 270 top
D10  24.6,13 90 top
D12  36.1,13 270 top
IC1  68.29,65.11 0 top
IC3  30.79,54.21 0 top
INA1  13.64,64.79 0 top
INA3  32.54,64.79 0 top
INA4  11.19,13.06 270 top
JP2  42.9,77.1 0 top
L2  59.7,60.6 0 top
L3  22.2,34.7 0 top
L4  22.2,49.7 0 top
L5  63.6,17.5 90 top
L6  54.6,34.8 0 top
LED1  77.45,46.5 90 top
LED2  77.45,49.9 90 top
LED4  69.1,11.5 0 top
LED5  74.1,11.5 0 top
LED6  79.1,11.5 0 top
LM2621-STEPUP1  57.51,48.2 0 top
R1  76.7,67.6 0 top
R2  19.8,68.3 180 top
R3  76.91,57.54 0 top
R4  69.7,60.6 0 top
R5  19.8,71.3 180 top
R6  8.82,68.52 90 top
R7  38.7,68.3 180 top
R8  38.7,71.3 180 top
R9  27.72,68.52 90 top
R10  69.7,57.6 0 top
R11  70.1,21.5 180 top
R12  76.64,11.46 90 top
R13  66.6,11.5 90 top
R14  36.2,39.7 0 top
R15  39.2,56.7 0 top
R16  39.41,46.64 0 top
R17  32.2,49.7 0 top
R18  32.2,46.7 0 top
R19  36.2,25.7 180 top
R20  29.1,25.64 0 top
R21  47.1,48.8 0 top
R22  62.1,51.8 180 top
R23  61.6,37.8 90 top
R24  58.6,31.8 90 top
R25  71.6,11.5 90 top
R26  44.1,23.5 0 top
R27  55.6,22.5 0 top
R28  76.6,19 0 top
R32  14.7,6.9 90 top
R33  17.7,6.9 90 top
R34  14.92,17.88 0 top
SJ1  13.8,68.3 0 top
SJ2  13.8,71.3 0 top
SJ3  74,33 0 top
SJ4  74,30 0 top
SJ5  32.7,68.3 0 top
SJ6  32.7,71.3 0 top
SJ7  14.7,12.9 270 top
SJ8  17.7,12.9 270 top
SJ9  72.2,73.5 180 top
SJ10  72.2,71.2 180 top
SPV1040-MPPT1  28.2,32.7 270 top

### Tracks (layer width: path | path; a pad name or v marks a point on that pad's centre or on a via)
3V3  (via drill 0.35)
  Top 0.2: 12.21,65.24 12.36,65.09 12.36,64.34
  Top 0.203: C1.1 16.59,63.49 INA1.4 | INA1.4 14.62,65.24 12.21,65.24 11.84,65.6 11.84,69.71 13.24,71.1 SJ2.1 | INA1.4 18.27,67.15 19.3,67.15 19.45,67.3 19.45,69.31 19.3,69.45 17.5,69.45 17.34,69.3 15.31,69.3 15.25,69.35 13.87,69.35 13.72,69.2 13.72,68.99 SJ1.1 | C3.1 37.25,65.25 35.49,63.49 INA3.4 | INA3.4 33.52,65.24 31.11,65.24 30.74,65.6 30.74,69.71 32.14,71.1 SJ6.1 | INA3.4 37.17,67.15 38.2,67.15 38.35,67.3 38.35,69.31 38.2,69.45 36.4,69.45 36.24,69.3 34.21,69.3 34.15,69.35 32.77,69.35 32.62,69.2 32.62,68.99 SJ5.1 | R6.1 9.02,65.52 11.05,63.49 11.51,63.49 12.36,64.34 12.97,64.34 13.12,64.19 13.12,63.69 INA1.2 | C4.1 9.89,10.11 9.89,12 INA4.4 | INA4.4 11.64,12.09 11.64,14.49 12,14.86 16.11,14.86 17.5,13.46 SJ8.1 | INA4.4 13.55,8.43 13.55,7.39 13.7,7.25 15.71,7.25 15.85,7.39 15.85,9.21 15.7,9.36 15.7,11.39 15.75,11.45 15.75,12.83 15.61,12.98 15.39,12.98 SJ7.1
  Top 0.406: 16.11,14.86 15.8,15.16 11.2,15.16 11.2,12.74 10.64,12.18 | v7.5,62.5 7.5,61.1 7.51,61.1 7.51,11.79 7.7,11.6 9.49,11.6 9.89,12 | v9,64 9.02,64.02 9.02,65.52 | 1K2.2 74.55,54.6 v74.3,54.6 | v37.5,63.3 37.25,63.55 37.25,65.25
  Top 0.813: SJ6.1 31.47,71.77 JP2.11 JP2.12 30.8,78.37 28.71,80.45 18.98,80.45 11.54,73.01 11.54,68.44 R6.1
  Bottom 0.406: v7.5,62.5 v9,64 | v74.3,54.6 46.2,54.6 v37.5,63.3
3V3_OUT  (via drill 0.35)
  Top 0.203: INA1.1 12.01,63.49 11.65,63.13 8.55,63.13 6.97,64.72 6.97,66.72 8.82,68.58 R6.2
  Top 0.305: R4.1 68.3,60.45 C10.2 64.98,57.6 64.07,56.7 53.91,56.7 L2.1
  Top 0.813: L2.1 50,69.9 C7.A | C7.A 47.49,70.74 C6.A | R6.2 10.57,73.07 10.57,73.41 18.59,81.42 65.85,81.42 68.35,78.92 68.35,77.65 v70,76 | v52.5,68 52.5,69.08 C7.A
  Bottom 0.813: v70,76 62,68 v52.5,68
5V  (via drill 0.35)
  Top 0.203: R9.1 29.95,63.49 30.41,63.49 31.26,64.34 31.87,64.34 32.02,64.19 32.02,63.69 INA3.2
  Top 0.406: 1K.2 75.15,42.6 v74.2,42.6 | v32.2,61.6 32.22,61.62 INA3.2
  Top 0.813: JP2.10 JP2.9 28.93,73.4 29.88,72.45 29.88,67.88 R9.1
  Bottom 0.406: v74.2,42.6 51.2,42.6 v32.2,61.6
5V_OUT  (via drill 0.35)
  Top 0.203: INA3.1 30.91,63.49 30.55,63.13 27.45,63.13 25.87,64.72 25.87,66.72 27.72,68.58 R9.2
  Top 0.305: R17.1 30.8,49.55 C24.2 27.48,46.7 26.57,45.8 16.41,45.8 L4.1
  Top 0.813: L4.1 12.5,59 13.05,59.55 | 13.05,59.55 C21.A 9.99,59.84 C20.A | R9.2 25.2,68.8 25.2,61.8 25.7,61.8 v26.6,60.9 | v15.7,56 15.7,56.9 13.05,59.55
  Bottom 0.813: v26.6,60.9 21.7,56 v15.7,56
BAT+  (via drill 0.35)
  Top 0.203: R34.1 9.89,15.65 9.89,15.19 10.74,14.34 10.74,13.73 10.6,13.58 10.09,13.58 INA4.2
  Top 0.305: 63.27,68.17 73.74,68.17 74.37,68.81 76.89,68.81 R1.2 | 25.77,57.27 36.24,57.27 36.87,57.91 39.4,57.91 R15.2
  Top 0.61: v20,16 18.99,16 18.81,15.82 14.18,15.82 R34.1 | v23.5,55 24.2,55.7 26.2,55.7
  Top 0.813: IC1.2 64.56,65.75 63.7,66.6 63.7,67.74 63.27,68.17 C5.1 58.89,72.55 46.66,72.55 46.19,72.08 46.19,62.29 R15.2 | IC3.2 27.05,54.84 26.2,55.7 26.2,56.84 25.77,57.27 C19.1 JP2.5 JP2.6
  Bottom 0.61: v20,16 20,51.5 v23.5,55
BAT_CHARGER
  Top 0.61: D8.1 67.33,33 SJ3.1 73.74,33.34 73.74,33.79 74.01,34.06 75.19,34.06 75.46,33.79 75.46,32.21 74.43,31.18 74.01,31.18 73.4,30.57 SJ4.1
BATT  (via drill 0.35)
  Top 0.203: v43.19,10.18 43.19,13 43.19,15.15 43.72,15.69 48.35,15.69 49.59,14.44 50.3,14.44 50.48,14.62 51.55,14.62 BT2.8 | v73.77,15.69 74.48,16.4 75.19,16.4 C58.1 | INA4.1 9.89,14.69 9.53,15.05 9.53,18.15 11.12,19.73 13.12,19.73 14.98,17.88 R34.2
  Top 0.61: 43.19,13 42.54,13 42.35,12.82 23.93,12.82 22.94,13.81 22.94,16.59 20.59,16.59 20.35,16.84 18.77,16.84 R34.2 | SJ3.2 74.26,32.66 74.26,32.21 73.99,31.94 73.7,31.94 72.54,30.79 72.54,29.21 73,28.75 v73,27.5
  Bottom 0.203: v43.19,10.18 60.62,10.18 61.5,9.29 67.37,9.29 v73.77,15.69
  Bottom 0.61: v73,27.5 73,16.46 v73.77,15.69
BST  (via drill 0.35)
  Top 0.203: v60.08,13.2 60.08,15.51 59.9,15.69 59.37,15.15 58.66,15.15 BT2.22 | v26.48,11.96 25.41,10.89 24.7,10.89 D10.C | v50.12,25.82 49.95,25.64 49.95,24.76 51.37,23.33 51.37,22.62 C53.1
  Bottom 0.203: v26.48,11.96 27.72,13.2 v60.08,13.2 60.26,13.2 61.33,12.13 66.3,12.13 68.08,13.91 68.08,14.98 57.24,25.82 v50.12,25.82
CCI  (via drill 0.35)
  Top 0.203: v57.06,16.4 57.24,16.4 57.41,16.58 58.48,16.58 BT2.24 | v59.37,21.02 59.37,22.27 59.55,22.45 C26.1
  Bottom 0.203: v57.06,16.4 57.06,18.71 v59.37,21.02
CCV
  Top 0.203: 45.86,20.49 52.08,20.49 55.46,17.11 58.48,17.11 BT2.25 | 45.86,20.49 45.5,20.84 C46.1 | 45.86,20.49 45.5,20.13 45.5,18.53 C18.1 | 45.86,20.49 C46.1 | R26.1 42.84,23.33 43.37,23.33 44.08,22.62 44.08,22.27 44.26,22.09 44.26,21.73 44.97,21.02 45.32,21.02 C46.1
CS  (via drill 0.35)
  Top 0.203: v57.06,14.98 57.06,14.8 57.24,14.62 58.48,14.62 BT2.21 | v61.15,18.53 62.75,18.53 63.46,19.25 L5.2 | v62.57,12.84 63.99,12.84 C57.1
  Bottom 0.203: v57.06,14.98 57.59,14.98 59.9,17.29 | v61.15,18.53 59.9,17.29 | v62.57,12.84 62.57,13.38 62.75,13.55 62.75,14.44 59.9,17.29
DIG7
  Top 0.406: SJ10.2 67.03,75.77 JP2.39
DIG8
  Top 0.406: SJ9.2 71.6,73.8 70.16,75.24 69.68,75.24 67.59,77.33 67.59,77.81 JP2.40
GND  (via drill 0.35)
  other vias: 56.6,50 59.6,45.3 62.1,45.3 62.1,47.3 57.5,49.8 56,70 56,65 44,65 44,67 62,73 44,63 28,62 37,62 34.1,43.7 41,35 21,63 18,63 19,58 16,54 18,51 49,9 54,12 48.9,16.1 11.2,65.2 79,72.9 71.5,79.6
  pour Top: 64,0 83,0 arc90 86,3 86,13.5 arc90 84.5,15 arc-90 83,16.5 83,69.5 arc-90 84.5,71 arc90 86,72.5 86,83 arc90 83,86 62.5,86 arc90 61,84.5 arc-90 59.5,83 26.5,83 arc-90 25,84.5 arc90 23.5,86 3,86 arc90 0,83 0,72.5 arc90 1.5,71 arc-90 3,69.5 3,16.5 arc-90 1.5,15 arc90 0,13.5 0,3 arc90 3,0 22,0 arc90 25,3 arc-90 28,6 58,6 arc-90 61,3 arc90
  pour Bottom: 64,0 83,0 arc90 86,3 86,13.5 arc90 84.5,15 arc-90 83,16.5 83,69.5 arc-90 84.5,71 arc90 86,72.5 86,83 arc90 83,86 62.5,86 arc90 61,84.5 arc-90 59.5,83 26.5,83 arc-90 25,84.5 arc90 23.5,86 3,86 arc90 0,83 0,72.5 arc90 1.5,71 arc-90 3,69.5 3,16.5 arc-90 1.5,15 arc90 0,13.5 0,3 arc90 3,0 22,0 arc90 25,3 arc-90 28,6 58,6 arc-90 61,3 arc90
HSD
  Top 0.203: 75.02,21.56 75.19,21.56 C50.1 75.02,21.56 | 75.02,21.56 71.64,21.56 R11.1 71.46,21.38 71.11,21.38 68.79,19.07 C49.1 68.62,18.89 68.08,18.89 67.19,18 67.19,17.47 | 75.02,21.56 75.02,23.87 C47.1 | BT2.10 51.55,13.2 51.55,13.73 BT2.9 51.73,13.91 53.33,13.91 57.59,9.64 59.55,9.64 61.15,11.24 61.15,17.29 61.33,17.47 | 61.33,17.47 61.5,17.29 65.59,17.29 65.77,17.47 67.19,17.47 | 61.33,17.47 60.97,17.82 58.66,17.82 BT2.26 | 67.19,17.47 68.08,16.58 68.62,16.58 C48.1
ISET+REF  (via drill 0.35)
  Top 0.203: 52.79,17.47 52.44,17.82 51.73,17.82 BT2.3 51.55,17.82 51.55,18.36 BT2.2 | 52.79,17.47 52.97,17.29 52.97,16.93 52.44,16.4 51.73,16.4 BT2.5 51.45,16.57 50.66,16.57 50.53,16.7 v49.9,16.7 | C56.1 54.21,25.82 54.21,22.62 R27.1 54.04,22.45 54.04,21.56 v53.5,21.02 | v52.97,17.64 52.79,17.47 | v49.31,13.83 50.28,13.83 50.47,13.65 50.47,12.87 50.61,12.72 51.4,12.72 BT2.11
  Bottom 0.203: v52.97,17.64 52.97,20.49 v53.5,21.02 | v49.31,13.83 49.9,14.42 v49.9,16.7
LX  (via drill 0.35)
  Top 0.203: BT2.19 58.66,13.2 58.66,13.73 BT2.20 58.48,13.91 v57.06,13.91 | v47.28,21.73 47.99,22.45 48.52,22.45 C53.2 | v42.48,16.4 41.41,15.33 40.7,15.33 D9.C | v62.04,13.91 63.46,15.33 63.46,15.69 L5.1
  Bottom 0.203: v47.28,21.73 47.28,21.2 46.92,20.84 | v42.48,16.4 46.92,20.84 | 46.92,20.84 53.86,13.91 v57.06,13.91 v62.04,13.91
MPPT_OUT  (1 unrouted)
  Top 0.406: 1K1.2 R19.1 34.95,23.03 34.64,23.03 34.43,22.82 34.43,22.51 | 390K1.2 33.62,21.7 34.43,22.51 | C27.1 57,34.8 L6.2 | 34.43,22.51 35.13,21.81 35.13,21.7
  Top 0.61: L6.2 49.7,34.8 46.54,31.64 40.56,31.64 1K1.2
N$1
  Top 0.203: INA1.8 12.66,66.93 12.2,67.39 12.2,69.2 13.24,70.25 13.73,70.25 13.88,70.39 13.88,70.88 14.29,71.3 SJ2.2 R5.2
N$2
  Top 0.203: R2.2 14.8,68.3 | 14.8,68.3 SJ1.2 | INA1.7 13.31,66.81 14.8,68.3
N$3
  Top 0.305: IC1.1 65.45,66.88 65.93,66.4 66.47,66.4 66.64,66.22 66.64,62.73 65.45,61.53 C8.2
N$4
  Top 0.305: C11.1 72.89,67.02 IC1.8
N$5
  Top 0.203: INA3.8 31.57,66.93 31.1,67.39 31.1,69.2 32.14,70.25 32.63,70.25 32.78,70.39 32.78,70.88 33.19,71.3 SJ6.2 R8.2
N$6
  Top 0.203: R7.2 33.7,68.3 | 33.7,68.3 SJ5.2 | INA3.7 32.22,66.81 33.7,68.3
N$7
  Top 0.813: L2.2 63.58,64.47 IC1.3 | C8.1 L2.2 | 58.7,60.6 L2.2
N$8
  Top 0.305: IC1.7 73.44,65.75 74.19,65 74.19,63.57 74.37,63.4 76.23,63.4 76.41,63.57 76.41,65.63 75.3,66.73 R1.1
N$9
  Top 0.305: C9.2 72.08,64.47 IC1.6
N$10
  Top 0.305: R3.2 77.95,57.9 C9.1
N$11
  Top 0.305: R10.2 R4.2 71.1,63.11 IC1.5
N$12
  Top 0.406: 1K2.1 78.85,50 LED2.A
N$13
  Top 0.406: 1K.1 78.85,46.4 LED1.A
N$15  (via drill 0.35)
  Top 0.203: 71.46,13.38 71.46,13.02 R25.2 71.46,13.38 | 71.46,13.38 71.46,13.55 70.57,14.44 67.55,14.44 v67.37,14.27 66.66,13.55 66.66,13.02 R13.2 | 71.46,13.38 72.53,14.44 75.73,14.44 76.62,13.55 76.62,13.02 R12.2 | 58.3,23.87 58.3,21.38 58.66,21.02 58.66,19.07 BT2.28 | 58.3,23.87 59.55,25.11 59.55,25.82 C52.1 | v37.86,15.33 36.26,15.33 D12.C | 58.3,23.87 v58.13,23.87
  Bottom 0.203: v37.86,15.33 39.63,15.33 47.99,23.69 47.99,24.76 48.35,25.11 56.88,25.11 v58.13,23.87 67.37,14.62 v67.37,14.27
N$16
  Top 0.203: LED5.C 74.13,12.84 74.13,12.31 75.37,11.07 75.37,10.89 75.19,10.71 75.19,8.75 75.02,8.58 54.57,8.58 52.61,10.53 51.73,10.53 BT2.14
N$17
  Top 0.406: L3.2 26.64,34.7 26.64,34.55 27.88,34.55 SPV1040-MPPT1.3 27.94,35.57 27.94,34.75 28.15,34.55 32.95,34.55 D3.A
N$18
  Top 0.406: R14.2 35.42,37.5 | SPV1040-MPPT1.1 31.75,35.64 33.6,37.5 35.42,37.5 | 35.42,37.5 35.42,37.48 35.61,37.29 35.61,34.89 32.13,31.41 25.31,31.41 20.64,26.75 20.64,24.65 20.85,24.44 26.67,24.44 26.73,24.38 28.62,24.38 29.11,24.86 29.11,29.69 SPV1040-MPPT1.8
N$19
  Top 0.305: IC3.1 27.95,55.98 28.43,55.5 28.97,55.5 29.14,55.32 29.14,51.83 27.95,50.63 C22.2
N$20
  Top 0.305: C25.1 35.38,56.12 IC3.8
N$21
  Top 0.813: L4.2 26.07,53.58 IC3.3 | C22.1 L4.2 | 21.2,49.7 L4.2
N$22
  Top 0.305: IC3.7 35.95,54.84 36.7,54.09 36.7,52.67 36.87,52.49 38.73,52.49 38.91,52.67 38.91,54.73 37.8,55.83 R15.1
N$23
  Top 0.305: C23.2 34.58,53.58 IC3.6
N$24
  Top 0.305: R16.2 40.45,47 C23.1
N$25
  Top 0.305: R18.2 R17.2 33.6,52.21 IC3.5
N$26
  Top 0.406: SPV1040-MPPT1.7 28.5,29.74 28.5,28.93 27.68,28.1 R20.1 27.62,25.7 C14.1
N$27
  Top 0.406: C14.2 26.64,30.54 26.64,30.65 26.85,30.86 27.6,30.86 27.81,30.65 27.81,29.83 SPV1040-MPPT1.6 27.94,29.83 27.94,30.65 28.15,30.86 32.62,30.86 1K1.1
N$28  (via drill 0.35)
  Top 0.406: 390K1.1 26.2,21.7 | 26.2,21.7 130K1.2 | SPV1040-MPPT1.5 26.2,28.74 v26.2,27.7 | v26.2,23.7 26.2,21.7
  Bottom 0.406: v26.2,27.7 v26.2,23.7
N$29  (via drill 0.35)
  Top 0.203: v60.44,20.49 60.97,21.02 60.97,23.69 61.5,24.22 63.46,24.22 64.88,25.64 78.93,25.64 79.64,24.93 79.64,15.33 79.11,14.8 79.11,13.02 LED6.C | v53.68,16.75 53.68,16.22 55.99,13.91 55.99,11.78 57.24,10.53 58.48,10.53 BT2.15
  Bottom 0.203: v60.44,20.49 60.44,21.02 59.73,21.73 55.99,21.73 53.68,19.42 v53.68,16.75
N$30  (via drill 0.35)
  Top 0.203: v68.44,11.6 68.97,12.13 68.97,12.84 LED4.C | v60.08,11.24 59.9,11.24 59.73,11.42 59.55,11.42 59.37,11.24 58.66,11.24 BT2.16
  Bottom 0.203: v68.44,11.6 64.88,11.6 62.93,9.64 61.68,9.64 v60.08,11.24
N$35
  Top 0.203: INA4.8 13.33,14.04 13.79,14.5 15.61,14.5 16.65,13.46 16.65,12.97 16.8,12.82 17.28,12.82 17.7,12.41 SJ8.2 R33.2
N$36  (via drill 0.35)
  Top 0.406: v56.6,45.8 57.6,45.8 58.1,46.3 58.1,47.69 58.91,48.5 59.69,48.5 LM2621-STEPUP1.7 59.78,48.59 60.56,48.59 60.77,48.8 60.77,49.55 60.7,49.61 R22.2 61.3,51.8 62.55,53.06 64.45,53.06 64.66,52.85 64.66,40.07 D8.2 | v53.1,45.8 51.86,44.56 D7.1 49.2,43.41 v49.2,41.6 | v43.6,41.9 43.5,42 C2.2
  Bottom 0.406: v56.6,45.8 v53.1,45.8 | v49.2,41.6 43.9,41.6 v43.6,41.9
N$37  (via drill 0.35)
  Top 0.406: LM2621-STEPUP1.6 59.78,47.94 60.7,47.94 63.05,50.3 | 63.05,50.3 63.5,50.75 R22.1 | R21.1 48.5,51.6 C30.1 57.6,51.8 v58.1,51.3 | v61.6,50.3 63.05,50.3 | LM2621-STEPUP1.2 55.38,48.46 56.16,48.46 56.31,48.3 v57.1,48.3
  Bottom 0.406: v58.1,51.3 58.6,50.8 | 58.6,50.8 59.1,50.3 v61.6,50.3 | v57.1,48.3 58.6,49.8 58.6,50.8
N$38  (via drill 0.35)
  Top 0.406: R21.2 v52.1,48.8 | v53.6,47.8 54.46,47.8 54.46,47.81 55.24,47.81 LM2621-STEPUP1.3
  Bottom 0.406: v52.1,48.8 52.6,48.8 v53.6,47.8
N$39
  Top 0.406: R24.2 61.6,36.2 R23.1 59.86,38.14 59.86,40.15 59.65,40.36 57.64,40.36 55.1,42.9 C28.2 55.31,43.8 LM2621-STEPUP1.4
N$40
  Top 0.406: R23.2 61.6,39.89 C28.1
N$42
  Top 0.406: L6.1 45.95,35.85 D7.2 48.93,47.54 52.25,47.54 55.51,50.8 57.56,50.8 57.8,50.57 58.32,50.57 LM2621-STEPUP1.8
N$43
  Top 0.203: R32.2 14.7,11.9 | 14.7,11.9 SJ7.2 | INA4.7 13.21,13.38 14.7,11.9
N$50  (via drill 0.35)
  Top 0.203: BT2.27 58.66,18.36 59.9,18.36 61.15,19.6 61.15,20.31 61.68,20.84 63.64,20.84 v63.99,21.2 68.44,21.2 68.62,21.38 R11.2 68.62,21.56 68.62,23.87 C51.1 | v32.52,15.33 30.74,15.33 D6.C
  Bottom 0.203: v32.52,15.33 36.79,15.33 38.21,16.75 40.52,16.75 47.63,23.87 47.63,24.93 49.24,26.53 58.66,26.53 v63.99,21.2
PGND  (via drill 0.35)
  Top 0.203: v57.06,12.49 57.24,12.49 57.41,12.67 58.48,12.67 BT2.18 | v62.57,10.36 63.81,10.36 63.99,10.18 C57.2 | v42.48,10.89 40.7,10.89 D9.A
  Bottom 0.203: v62.57,10.36 60.44,12.49 v57.06,12.49 55.46,10.89 v42.48,10.89
SCL1  (via drill 0.35)
  Top 0.203: INA1.5 15.88,66.09 v16.44,66.66 | INA3.5 34.77,66.09 v35.34,66.66 | INA4.5 12.49,10.82 v13.06,10.26
  Bottom 0.406: 34.3,66.66 33.97,67 33.97,67.6 34.4,68.03 37.95,68.03 45.29,75.37 45.29,76.95 JP2.24 | v35.34,66.66 35.09,66.66 35,66.57 34.4,66.57 34.3,66.66 | 34.3,66.66 v16.44,66.66 16.44,66.91 16.53,67 16.53,67.6 16.1,68.03 15.5,68.03 12.97,65.5 12.97,10.6 13.06,10.51 v13.06,10.26
SDA1  (via drill 0.35)
  Top 0.203: INA1.6 14.16,66.29 14.16,66.8 14.61,67.25 15.25,67.25 15.31,67.3 v15.8,67.3 | INA3.6 33.06,66.29 33.06,66.8 33.51,67.25 34.15,67.25 34.21,67.3 v34.7,67.3 | INA4.6 12.69,12.54 13.2,12.54 13.65,12.09 13.65,11.45 13.7,11.39 v13.7,10.9
  Bottom 0.406: JP2.23 38.18,67.3 35.74,67.3 | 35.74,67.3 35.65,67.39 35.04,67.39 34.95,67.3 v34.7,67.3 | 35.74,67.3 36.08,66.96 36.08,66.35 35.65,65.92 16.14,65.92 15.71,66.35 15.71,66.96 15.8,67.05 v15.8,67.3 13.7,65.2 v13.7,10.9
SOL+
  Top 0.406: R14.1 17.5,39.7 L3.1 12.5,34 12.5,29 C15.2
  Top 0.61: 12.5,34 12.5,44.9 8.79,48.61 8.79,61.14 10.09,62.43 13.24,62.43 14.4,61.28 14.4,59.42 16.01,57.81 16.33,58.13 17.43,58.13 19.66,60.36 19.66,66.71 19.89,66.94 22.19,66.94 22.63,67.38 22.63,78.88 23.34,79.59 24.36,79.59 25.07,78.88 25.07,77.15 JP2.7
THM  (via drill 0.35)
  Top 0.203: 51.5,17.03 51.26,17.27 50.61,17.27 50.38,17.5 v49.3,17.5
  Top 0.406: SJ9.1 74.2,72.1 | 74.2,72.1 76.99,69.31 78.59,69.31 79.26,68.65 79.26,66.55 79.05,66.34 77.42,66.34 76.91,65.84 76.91,59.96 76.6,59.64 75.31,59.64 72.8,57.14 72.8,36.8 70.5,34.5 v69.5,34.5 | 51.5,17.03 BT2.4 | SJ10.1 73.3,71.2 74.2,72.1
  Bottom 0.406: v69.5,34.5 61.99,26.99 43.14,26.99 31.79,15.64 31.79,15.03 32.22,14.6 41.72,14.6 44.12,17 48.7,17 48.7,17.4 48.8,17.5 v49.3,17.5
TM1
  Top 0.203: BT2.13 51.55,11.24 50.66,11.24 50.48,11.42 50.3,11.24 47.81,11.24 47.63,11.42 C43.1
TM2
  Top 0.203: BT2.12 51.55,11.96 50.48,11.96 50.3,11.78 48.17,13.91 47.63,13.91 C44.1
VADJ  (via drill 0.35)
  Top 0.203: v53.33,15.51 52.97,15.15 51.73,15.15 BT2.7 | v56.35,21.02 56.88,21.56 56.88,22.45 R27.2 | v66.13,14.8 66.3,14.98 67.73,14.98 67.91,14.8 72.53,14.8 73.06,15.33 73.06,17.47 74.48,18.89 75.19,18.89 R28.1
  Bottom 0.203: v53.33,15.51 53.86,16.04 54.04,16.04 55.1,17.11 | 55.1,17.11 56.35,18.36 v56.35,21.02 | v66.13,14.8 61.68,19.25 60.79,19.25 57.77,16.22 57.77,16.04 57.41,15.69 56.52,15.69 55.1,17.11
VIN14V
  Top 0.203: D12.A 36.08,10.89 30.74,10.89 D6.A
  Top 0.61: D12.A 37.56,10.8 40.35,8.02 79.26,8.02 80.31,9.06 80.31,25.06 79.16,26.2 78.4,26.2 SJ4.2
VL  (via drill 0.35)
  Top 0.203: BT2.17 58.48,11.78 56.7,11.78 56.35,12.13 56.35,15.51 52.79,19.07 51.73,19.07 BT2.1 51.55,18.89 51.37,19.07 51.37,19.25 50.66,19.96 50.48,19.96 v50.3,19.78 47.46,16.93 44.44,16.93 42.84,15.33 42.84,14.09 42.12,13.38 29.14,13.38 27.37,15.15 24.7,15.15 D10.A | v48.7,24.4 48.7,25.82 C54.1
  Bottom 0.203: v48.7,24.4 48.7,21.38 v50.3,19.78
VOUT  (via drill 0.35)
  Top 0.406: D3.C 38.1,32.2 C13.1 37.6,30.88 36.47,29.75 36.47,27.39 R19.2 34.72,25.64 R20.2 30.52,28.02 v31.2,28.7 | v25.2,36.7 26.16,36.7 SPV1040-MPPT1.4
  Bottom 0.406: v31.2,28.7 25.2,34.7 v25.2,36.7

### Text on the board
tNames: 3V3 | 5V | Z-PWR V1.0 - ZENITH 2018